# Altium schematic sheet PunkController-Schematics.SchDoc: Punk Controller
size A4; CompanyName: EFAB - UTFPR; Engineer: Leonardo Basso Furini
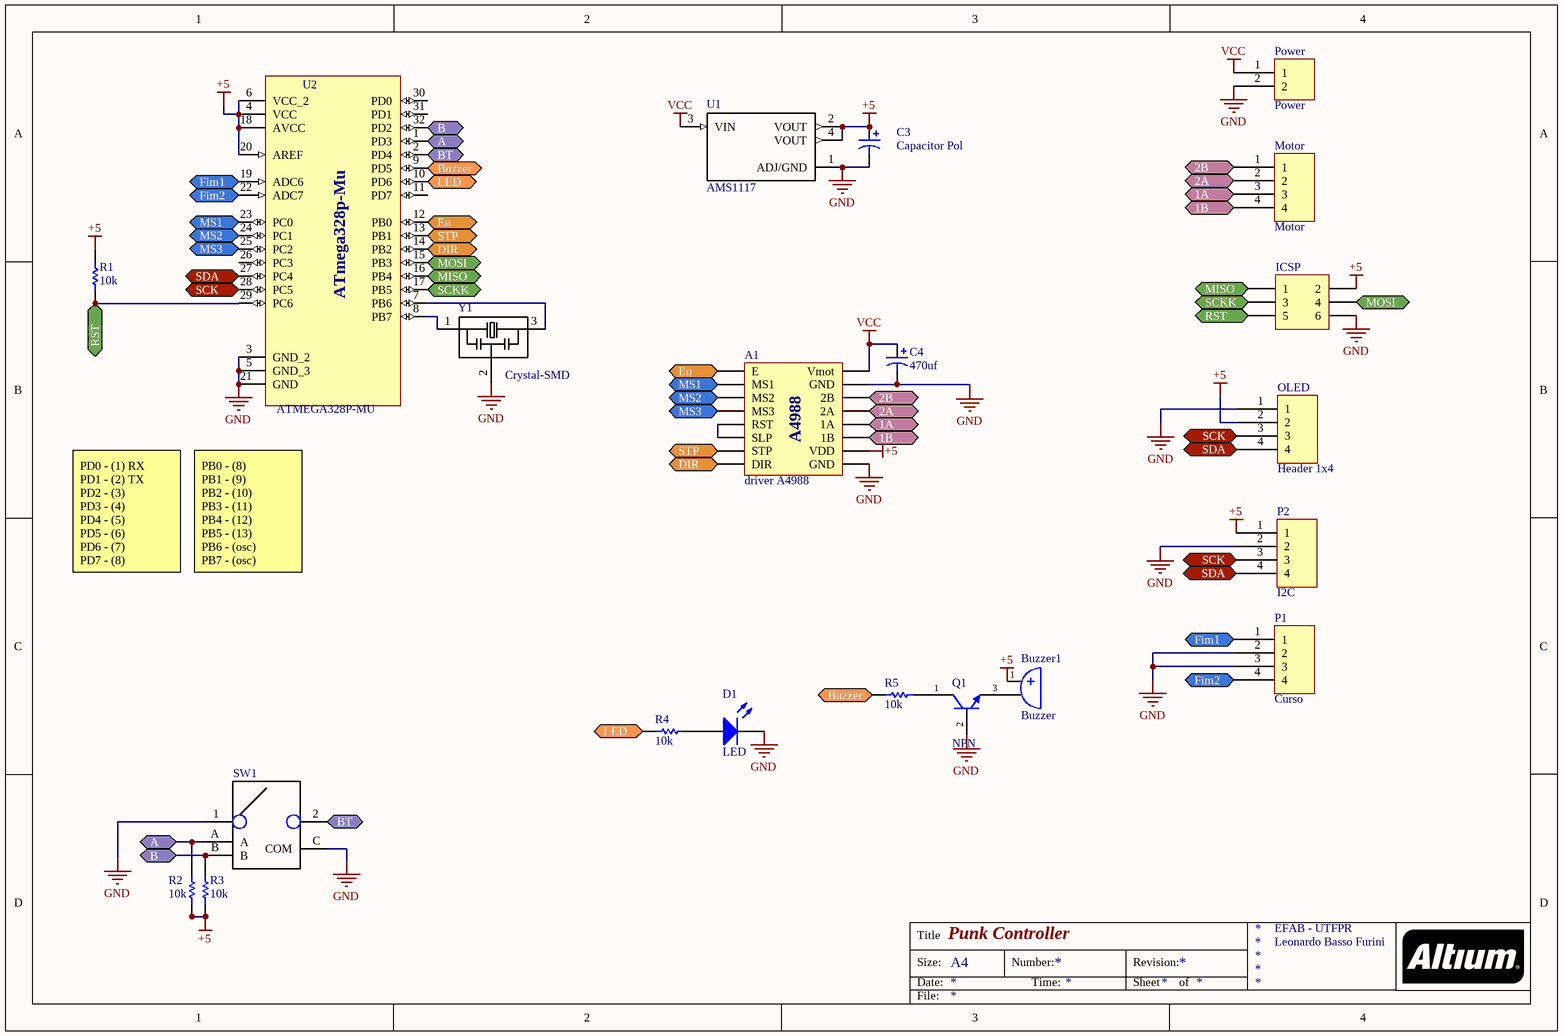
[diagram p0: PunkController-Schematics.SchDoc]

## Parts
A1  driver A4988  [a4988]
Buzzer1  Buzzer  [Buzzer 12mm]
C3  Capacitor Pol  [Cap_Al_SMD_C6_10x10mm]
C4  470uf  [Cap_Al_SMD_C6_10x10mm]
D1  LED  [LED-0603-R]
ICSP  Header 3X2  [HDR2X3M]  (value not drawn)
Motor  Motor  [KRE-4]
OLED  Header 1x4  [HDR1x4M]
P1  Curso  [HDR1X4-D]
P2  I2C  [HDR1X4-D]
Power  Power  [KRE-2]
Q1  NPN  [SOT23]
R1  10k  [R1005[0402]]
R2  10k  [R1005[0402]]
R3  10k  [R1005[0402]]
R4  10k  [R2012[0805]]
R5  10k  [R1608[0603]]
SW1  PEC11R-4215F-S0024  [Encoder]  (value not drawn)
U1  AMS1117  [AMS1117]
U2  ATMEGA328P-MU  [Atmega smd]
Y1  Crystal-SMD  [Crystal-SMD]

## Ports
1A (bidir), 1B (bidir), 2A (bidir), 2B (bidir), A (bidir), B (bidir), BT (bidir), Buzzer (bidir), DIR (bidir), En (bidir), Fim1 (bidir), Fim2 (bidir), LED (bidir), MISO (bidir), MOSI (bidir), MS1 (bidir), MS2 (bidir), MS3 (bidir), RST (bidir), SCK (bidir), SCKK (bidir), SDA (bidir), STP (bidir)

## Nets
+5: A1.10(VDD) Buzzer1.1 C3.1 ICSP.2 OLED.2 P2.1 R1.2 R2.1 R3.1 U1.2(VOUT) U1.4(VOUT) U2.4(VCC) U2.6(VCC_2) U2.18(AVCC) U2.20(AREF)
GND: A1.9(GND) A1.15(GND) C3.2 C4.2 D1.2(K) ICSP.6 OLED.1 P1.2 P1.3 P2.2 Power.2 Q1.2(B) SW1.1 SW1.C(COM) U1.1(ADJ/GND) U2.3(GND_2) U2.5(GND_3) U2.21(GND) Y1.2
VCC: A1.16(Vmot) C4.1 Power.1 U1.3(VIN)
1A: A1.12(1A) Motor.3 ; port 1A
1B: A1.11(1B) Motor.4 ; port 1B
2A: A1.13(2A) Motor.2 ; port 2A
2B: A1.14(2B) Motor.1 ; port 2B
A: R2.2 SW1.A U2.1(PD3) ; port A
B: R3.2 SW1.B U2.32(PD2) ; port B
BT: SW1.2 U2.2(PD4) ; port BT
Buzzer: R5.1 U2.9(PD5) ; port Buzzer
DIR: A1.8(DIR) U2.14(PB2) ; port DIR
En: A1.1(E) U2.12(PB0) ; port En
Fim1: P1.1 U2.19(ADC6) ; port Fim1
Fim2: P1.4 U2.22(ADC7) ; port Fim2
LED: R4.1 U2.10(PD6) ; port LED
MISO: ICSP.1 U2.16(PB4) ; port MISO
MOSI: ICSP.4 U2.15(PB3) ; port MOSI
MS1: A1.2(MS1) U2.23(PC0) ; port MS1
MS2: A1.3(MS2) U2.24(PC1) ; port MS2
MS3: A1.4(MS3) U2.25(PC2) ; port MS3
RST: ICSP.5 R1.1 U2.29(PC6) ; port RST
SCK: OLED.3 P2.3 U2.28(PC5) ; port SCK
SCKK: ICSP.3 U2.17(PB5) ; port SCKK
SDA: OLED.4 P2.4 U2.27(PC4) ; port SDA
STP: A1.7(STP) U2.13(PB1) ; port STP
NetA1_5: A1.5(RST) A1.6(SLP)
NetBuzzer1_2: Buzzer1.2 Q1.3(E)
NetD1_1: D1.1(A) R4.2
NetQ1_1: Q1.1(C) R5.2
NetU2_7: U2.7(PB6) Y1.3
NetU2_8: U2.8(PB7) Y1.1

Not connected (* = marked no-connect by the designer): U2 11(PD7) 26(PC3) 30(PD0) 31(PD1)

## Notes on the sheet
- PD0 - (1) RX
  PD1 - (2) TX
  PD2 - (3)
  PD3 - (4)
  PD4 - (5)
  PD5 - (6)
  PD6 - (7)
  PD7 - (8)
- PB0 - (8)
  PB1 - (9)
  PB2 - (10)
  PB3 - (11)
  PB4 - (12)
  PB5 - (13)
  PB6 - (osc)
  PB7 - (osc)
- Title
- Size:
- Date:
- A4
- Number:
- Time:
- Revision:
- Sheet
- of
- File:
- (in symbol ATMEGA328P-MU-SMD) ATmega328p-Mu
- (in symbol driver A4988) A4988

## Library data of the parts
C3 C4 = CP: Polarized Capacitor; Manufacturer: *; PartNumber: *; Package Type: *; Value: *
ICSP = Header 3X2: Header, 3-Pin, Dual row; LatestRevisionDate: 17-Jul-2002; LatestRevisionNote: Re-released for DXP Platform.; Publisher: Altium Limited
Motor P1 P2 = Header 1x4
Power = Header 2
Q1 = NPN: NPN Bipolar Transistor; Manufacturer: *; PartNumber: *; Package Type: *
R1-R5 = R: Resistor; Value: 0; Manufacturer: *; PartNumber: *; Package Type: *
SW1 = Encoder: Incremental Encoder, 12 Mm, Contact Rating 10 Ma - 5 Vdc; MF: Bourns; Price: None; Package: None; SnapEDA_Link: https://www.snapeda.com/parts/PEC11R-4215F-S0024/Bourns%20-%20J.W.%20Miller/view-part/?ref=snap; Availability: Unavailable; MP: PEC11R-4215F-S0024; Value: *
U2 = ATMEGA328P-MU-SMD: Embedded microcontroller ATMEGA328P-MU VQFN 32 _5x5_ Microchip Technology 8-Bit 20 MHz I/O number 23; Price: None; MF: Microchip; Package: VQFN-32 Microchip; SnapEDA_Link: https://www.snapeda.com/parts/ATMEGA328P-MU/Microchip/view-part/?ref=snap; Availability: Unavailable; MP: ATMEGA328P-MU; Value: *
Buzzer1 = Buzzer: Manufacturer: *; PartNumber: *; Package Type: *
D1 = LED: Manufacturer: *; PartNumber: *; Package Type: *